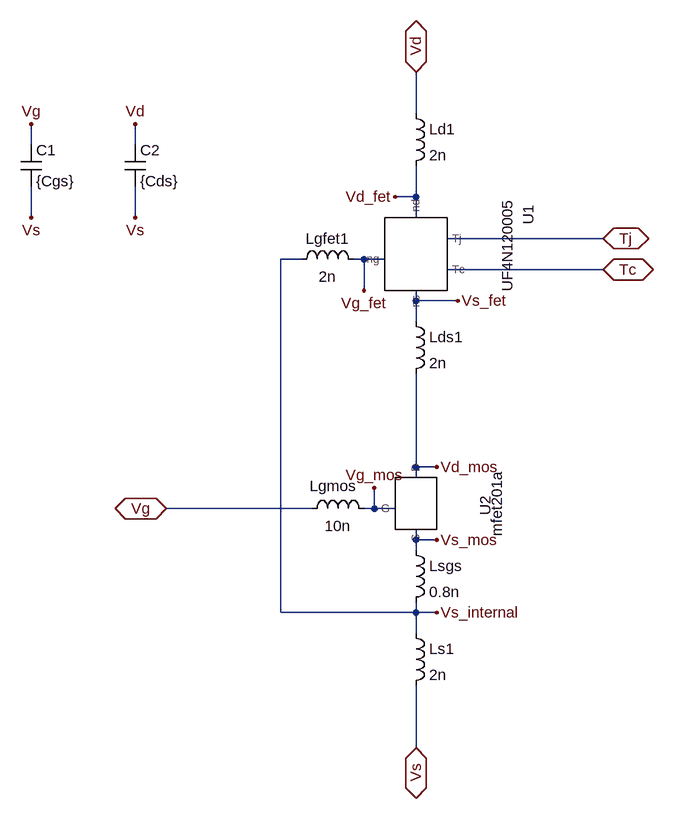
[diagram p0: schematic CCJFET.asc]
CCJFET.asc, the LTspice schematic file:
Version 4
SHEET 1 880 776
WIRE 240 -288 240 -352
WIRE -352 -240 -352 -272
WIRE -192 -240 -192 -272
WIRE 240 -160 240 -208
WIRE 240 -160 208 -160
WIRE -352 -128 -352 -176
WIRE -192 -128 -192 -176
WIRE 240 -128 240 -160
WIRE 528 -96 288 -96
WIRE 64 -64 32 -64
WIRE 160 -64 144 -64
WIRE 192 -64 160 -64
WIRE 528 -48 288 -48
WIRE 160 -16 160 -64
WIRE 240 0 240 -16
WIRE 304 0 240 0
WIRE 240 32 240 0
WIRE 240 256 240 112
WIRE 272 256 240 256
WIRE 240 272 240 256
WIRE 80 320 -144 320
WIRE 176 320 176 288
WIRE 176 320 160 320
WIRE 208 320 176 320
WIRE 240 368 240 352
WIRE 272 368 240 368
WIRE 240 384 240 368
WIRE 32 480 32 -64
WIRE 240 480 240 464
WIRE 240 480 32 480
WIRE 272 480 240 480
WIRE 240 512 240 480
WIRE 240 688 240 592
FLAG 176 288 Vg_mos
FLAG 208 -160 Vd_fet
FLAG 160 -16 Vg_fet
FLAG 304 0 Vs_fet
FLAG 272 256 Vd_mos
FLAG 272 368 Vs_mos
FLAG 272 480 Vs_internal
FLAG 528 -96 Tj
IOPIN 528 -96 BiDir
FLAG 528 -48 Tc
IOPIN 528 -48 BiDir
FLAG 240 -352 Vd
IOPIN 240 -352 BiDir
FLAG 240 688 Vs
IOPIN 240 688 BiDir
FLAG -144 320 Vg
IOPIN -144 320 BiDir
FLAG -352 -272 Vg
FLAG -352 -128 Vs
FLAG -192 -272 Vd
FLAG -192 -128 Vs
SYMBOL ind 224 368 R0
SYMATTR InstName Lsgs
SYMATTR Value 0.8n
SYMBOL ind 224 496 R0
SYMATTR InstName Ls1
SYMATTR Value 2n
SYMBOL ind 64 336 R270
WINDOW 0 35 49 VTop 2
WINDOW 3 5 56 VBottom 2
SYMATTR InstName Lgmos
SYMATTR Value 10n
SYMBOL ind 224 -304 R0
SYMATTR InstName Ld1
SYMATTR Value 2n
SYMBOL ind 48 -48 R270
WINDOW 0 32 56 VTop 2
WINDOW 3 5 56 VBottom 2
SYMATTR InstName Lgfet1
SYMATTR Value 2n
SYMBOL ind 224 16 R0
SYMATTR InstName Lds1
SYMATTR Value 2n
SYMATTR SpiceLine Rser={Rdson}
SYMBOL cap -368 -240 R0
SYMATTR InstName C1
SYMATTR Value {Cgs}
SYMBOL cap -208 -240 R0
SYMATTR InstName C2
SYMATTR Value {Cds}
SYMBOL UF4N120005 240 -80 R0
WINDOW 0 157 -52 VTop 2
SYMATTR InstName U1
SYMATTR SpiceLine Vth = {Vth_FET}
SYMATTR ModelFile C:\Users\Nick\Desktop\ThesisSim\FullSim\Vth_Step\UF4N120005_ET_A.txt
SYMBOL mfet201a 240 320 R0
WINDOW 0 91 -4 VTop 2
SYMATTR InstName U2
SYMATTR SpiceLine Vth = {Vth_MOS}
SYMATTR ModelFile C:\Users\Nick\Desktop\ThesisSim\FullSim\Vth_Step\mosfetuni.txt

The netlist it stands for:
* CCJFET.asc
Lsgs Vs_mos Vs_internal 0.8n
Ls1 Vs_internal Vs 2n
Lgmos Vg Vg_mos 10n
Ld1 Vd Vd_fet 2n
Lgfet1 Vs_internal Vg_fet 2n
Lds1 Vs_fet Vd_mos 2n Rser={Rdson}
C1 Vg Vs {Cgs}
C2 Vd Vs {Cds}
XU1 Vd_fet Vg_fet Vs_fet Tj Tc UF4N120005 Vth = {Vth_FET}  ; pins nd ng ns Tj Tc
XU2 Vd_mos Vg_mos Vs_mos mfet201a Vth = {Vth_MOS}  ; pins D G S
.lib C:\Users\Nick\Desktop\ThesisSim\FullSim\Vth_Step\UF4N120005_ET_A.txt
.lib C:\Users\Nick\Desktop\ThesisSim\FullSim\Vth_Step\mosfetuni.txt
.backanno
.end